# EAGLE design LoraBerry V2.2 (EAGLE 6.6.0)
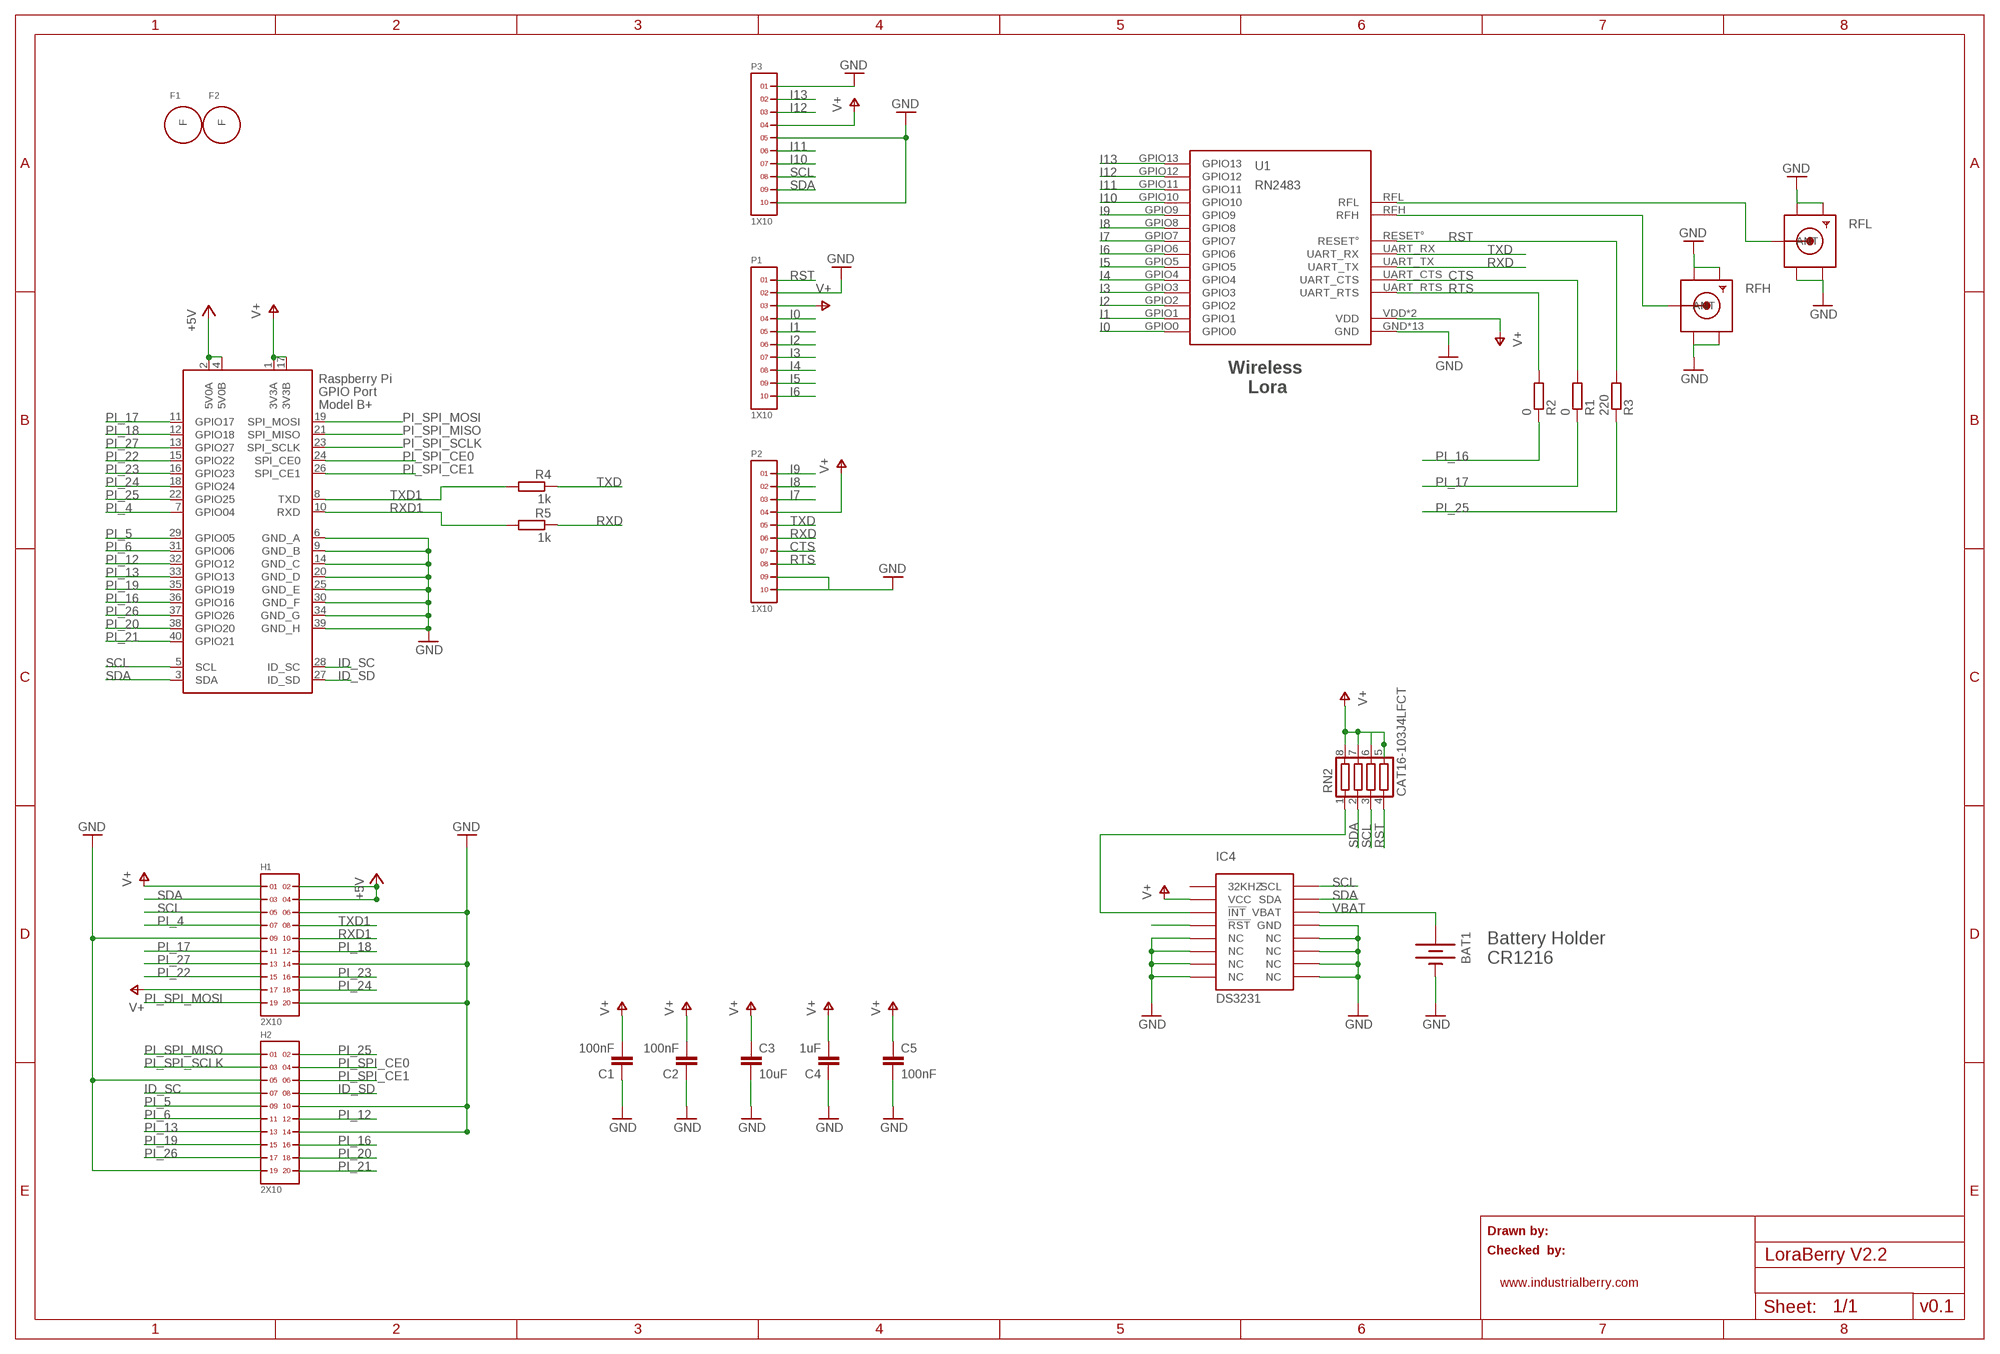
[diagram p0: schematic, sheet 1]

## Parts
BAT1  BATTERY12MM  [BATTCON_12MM]
C1  100nF  C-EUC0603  [C0603]
C2  100nF  C-EUC0603  [C0603]
C3  10uF  C-EUC1206  [C1206]
C4  1uF  C-EUC0603  [C0603]
C5  100nF  C-EUC0603  [C0603]
F1  FIDUCIAL-LAMINA  [FIDUCIAL-LAMINA]
F2  FIDUCIAL-LAMINA  [FIDUCIAL-LAMINA]
H1  2X10  [2X10]
H2  2X10  [2X10]
IC4  DS3231  DS3231SOIC-16W  [SOIC-16W]
P1  1X10  [1X10]
P2  1X10  [1X10]
P3  1X10  [1X10]
R1  0  R-EU_R0603  [R0603]
R2  0  R-EU_R0603  [R0603]
R3  220  R-EU_R0603  [R0603]
R4  1k  R-EU_R0603  [R0603]
R5  1k  R-EU_R0603  [R0603]
RFH  SMACONNECTOR_EDGE  [SMA_EDGELAUNCH]
RFL  SMACONNECTOR_EDGE  [SMA_EDGELAUNCH]
RN2  CAT16-103J4LFCT  CTS742C083  [CTS742C083]
RPI1  RASPBERRY_HATNODISPLAY  [CONNECTOR_B+_SMT_HAT_ND]
U1  RN2483  [RN2483]

## Nets
433MHZ: RFL.P(ANT) U1.RFL
868MHZ: RFH.P(ANT) U1.RFH
+5V: H1.2 H1.4 RPI1.2(5V0A) RPI1.4(5V0B)
CTS: P2.7 R1.2 U1.UART_CTS
GND: BAT1.GND(-) C1.1 C2.1 C3.2 C4.1 C5.2 H1.6 H1.9 H1.14 H1.20 H2.5 H2.10 H2.14 H2.19 IC4.5(NC) IC4.6(NC) IC4.7(NC) IC4.8(NC) IC4.9(NC) IC4.10(NC) IC4.11(NC) IC4.12(NC) IC4.13(GND) P1.2 P2.9 P2.10 P3.1 P3.5 P3.10 RFH.GND@1(GND4) RFH.GND@2(GND3) RFH.GND@3(GND2) RFH.GND@4(GND1) RFL.GND@1(GND4) RFL.GND@2(GND3) RFL.GND@3(GND2) RFL.GND@4(GND1) RPI1.6(GND_A) RPI1.9(GND_B) RPI1.14(GND_C) RPI1.20(GND_D) RPI1.25(GND_E) RPI1.30(GND_F) RPI1.34(GND_G) RPI1.39(GND_H) U1.GND U1.GND1(GND) U1.GND2(GND) U1.GND3(GND) U1.GND4(GND) U1.GND5(GND) U1.GND6(GND) U1.GND7(GND) U1.GND8(GND) U1.GND9(GND) U1.GND10(GND) U1.GND11(GND) U1.GND12(GND)
I0: P1.4 U1.GPIO0
I1: P1.5 U1.GPIO1
I2: P1.6 U1.GPIO2
I3: P1.7 U1.GPIO3
I4: P1.8 U1.GPIO4
I5: P1.9 U1.GPIO5
I6: P1.10 U1.GPIO6
I7: P2.3 U1.GPIO7
I8: P2.2 U1.GPIO8
I9: P2.1 U1.GPIO9
I10: P3.7 U1.GPIO10
I11: P3.6 U1.GPIO11
I12: P3.3 U1.GPIO12
I13: P3.2 U1.GPIO13
ID_SC: H2.7 RPI1.28(ID_SC)
ID_SD: H2.8 RPI1.27(ID_SD)
N$1: IC4.4(!RST)
N$4: IC4.3(!INT) RN2.1
PI_4: H1.7 RPI1.7(GPIO04)
PI_5: H2.9 RPI1.29(GPIO05)
PI_6: H2.11 RPI1.31(GPIO06)
PI_12: H2.12 RPI1.32(GPIO12)
PI_13: H2.13 RPI1.33(GPIO13)
PI_16: H2.16 R2.1 RPI1.36(GPIO16)
PI_17: H1.11 R1.1 RPI1.11(GPIO17)
PI_18: H1.12 RPI1.12(GPIO18)
PI_19: H2.15 RPI1.35(GPIO19)
PI_20: H2.18 RPI1.38(GPIO20)
PI_21: H2.20 RPI1.40(GPIO21)
PI_22: H1.15 RPI1.15(GPIO22)
PI_23: H1.16 RPI1.16(GPIO23)
PI_24: H1.18 RPI1.18(GPIO24)
PI_25: H2.2 R3.1 RPI1.22(GPIO25)
PI_26: H2.17 RPI1.37(GPIO26)
PI_27: H1.13 RPI1.13(GPIO27)
PI_SPI_CE0: H2.4 RPI1.24(SPI_CE0)
PI_SPI_CE1: H2.6 RPI1.26(SPI_CE1)
PI_SPI_MISO: H2.1 RPI1.21(SPI_MISO)
PI_SPI_MOSI: H1.19 RPI1.19(SPI_MOSI)
PI_SPI_SCLK: H2.3 RPI1.23(SPI_SCLK)
RST: P1.1 R3.2 RN2.4 U1.RESET°
RTS: P2.8 R2.2 U1.UART_RTS
RXD: P2.6 R5.1 U1.UART_TX
RXD1: H1.10 R5.2 RPI1.10(RXD)
SCL: H1.5 IC4.16(SCL) P3.8 RN2.3 RPI1.5(SCL)
SDA: H1.3 IC4.15(SDA) P3.9 RN2.2 RPI1.3(SDA)
TXD: P2.5 R4.1 U1.UART_RX
TXD1: H1.8 R4.2 RPI1.8(TXD)
V+: C1.2 C2.2 C3.1 C4.2 C5.1 H1.1 H1.17 IC4.2(VCC) P1.3 P2.4 P3.4 RN2.5 RN2.6 RN2.7 RN2.8 RPI1.1(3V3A) RPI1.17(3V3B) U1.VDD U1.VDD2(VDD)
VBAT: BAT1.PWR@1(+) IC4.14(VBAT)
Unconnected: F1.P$1(F) F2.P$1(F) IC4.1(32KHZ)

## Notes on the sheet
- Wireless 
  Lora
- Battery Holder 
  CR1216
- Drawn by:
- Checked  by:
- www.industrialberry.com
- v0.1

## Library data of the parts
BAT1 = SparkFun:BATTERY: Battery Holders Various common sizes : AA, AAA, 20mm coin cell and 12mm coin cell.
C1-C5 = rcl:C-EU: CAPACITOR, European symbol
F1 F2 = PierpaoloSmartSpaceSolutions:FIDUCIAL-LAMINA
H1 H2 = headers(.1in):2X10
IC4 = DS3231_industrialberry:DS3231
P1-P3 = headers(2mm):1X10
R1-R5 = rcl:R-EU_: RESISTOR, European symbol
RFH RFL = adafruit:SMACONNECTOR: SMA Connector 90° DIP SMA Connector, 50 Ohm (4UConnector: 07259)
RN2 = resistor-net:CTS742C083: Chip Resistor Array 4 Single Resistor Source: http://www.ctscorp.com/components/Datasheets/CTSChipArrayDs.pdf; OC_FARNELL: unknown; OC_NEWARK: unknown
RPI1 = Connector_B+:RASPBERRY_HAT
U1 = tobias:RN2483: RN2483 Microchip Low-Power Lora Transceiver Module NOT TESTED There are testpads on the bottom of the device. The mask is supposed to cover that, but I have not tested it in practice yet. Info: http://www.microchip.com/wwwproducts/Devices.aspx?product=RN2483 Datasheet: http://ww1.microchip.com/downloads/en/DeviceDoc/50002346B.pdf Adapted from: https://github.com/Octanis1/Octanis1-Electronics/blob/ae493cac28c100e20856abe563dfe8824e9cc4bd/lib/Octanis1.lbr

## Board
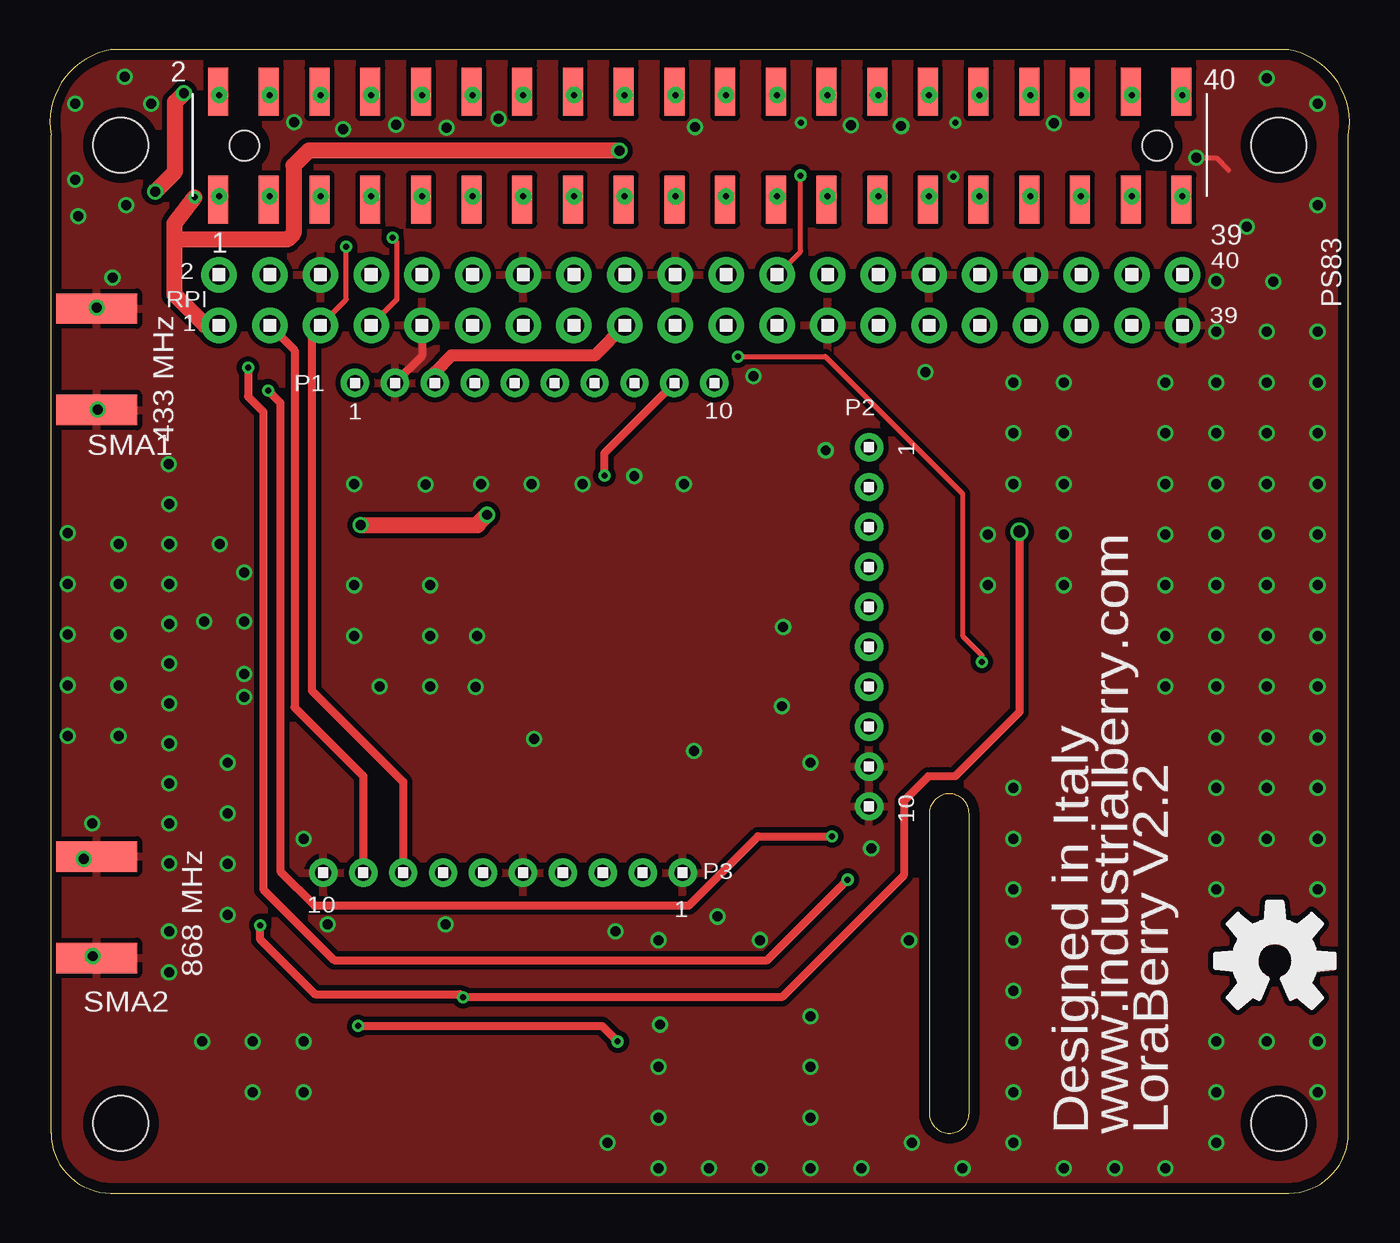
[diagram p1: board, top side]
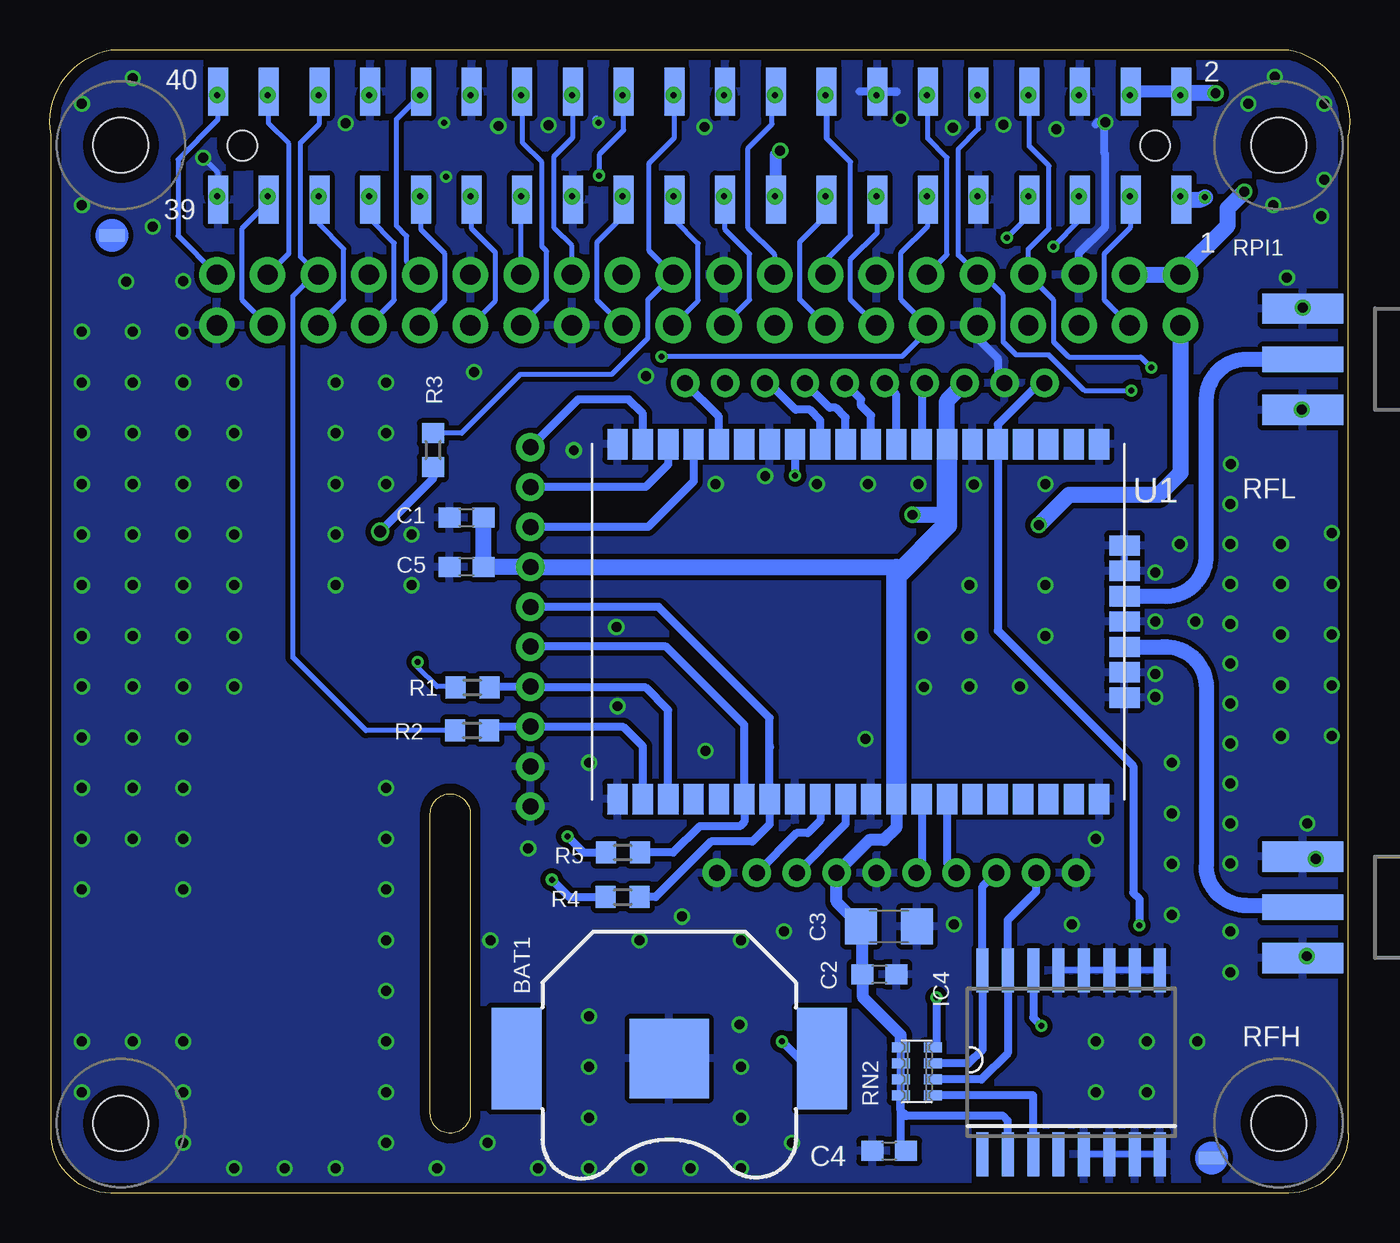
[diagram p2: board, bottom side, seen from below]

Size 65.11 x 57.27 mm. Coordinates in mm from the lower left corner, seen from the top.
Copper layers (1*16): Top 0.035mm / dielectric 1.5mm / Bottom 0.035mm
Design rules "ITEADstudio_DRC *": minimum track width 10mil, minimum drill 12mil, track to track 10mil, track to pad 10mil, pad to pad 10mil, via to via 10mil, smd to smd 0mil, copper to edge 20mil, drill to drill 20mil, minimum pad ring 10mil, minimum via ring 6mil, stop-mask expansion 2mil, vias tented up to drill 100mil, thermal gap 10mil

### Footprints (pad centres in the part's own frame; a part is rotated, then mirrored left to right if it is on the bottom)
BATTCON_12MM = smd 3.962 x 3.962: GND 0,0 | smd 2.5 x 5.1: PWR@1 -7.65,0; PWR@2 7.65,0
C0603 = smd 1.1 x 1: 1 -0.85,0; 2 0.85,0
C1206 = smd 1.6 x 1.8: 1 -1.4,0; 2 1.4,0
FIDUCIAL-LAMINA = smd 1.27 x 0.635: P$1 0,0
2X10 = drill 1.016 pad 1.778: 1 0,0; 2 0,2.54; 3 2.54,0; 4 2.54,2.54; 5 5.08,0; 6 5.08,2.54; 7 7.62,0; 8 7.62,2.54; 9 10.16,0; 10 10.16,2.54; 11 12.7,0; 12 12.7,2.54; 13 15.24,0; 14 15.24,2.54; 15 17.78,0; 16 17.78,2.54; 17 20.32,0; 18 20.32,2.54; 19 22.86,0; 20 22.86,2.54
SOIC-16W = smd 0.6 x 2.2: 1 -4.445,-4.6; 2 -3.175,-4.6; 3 -1.905,-4.6; 4 -0.635,-4.6; 5 0.635,-4.6; 6 1.905,-4.6; 7 3.175,-4.6; 8 4.445,-4.6; 9 4.445,4.6; 10 3.175,4.6; 11 1.905,4.6; 12 0.635,4.6; 13 -0.635,4.6; 14 -1.905,4.6; 15 -3.175,4.6; 16 -4.445,4.6
1X10 = drill 0.8 pad 1.422: 1 -9,0; 2 -7,0; 3 -5,0; 4 -3,0; 5 -1,0; 6 1,0; 7 3,0; 8 5,0; 9 7,0; 10 9,0
R0603 = smd 1 x 1.1: 1 -0.85,0; 2 0.85,0
SMA_EDGELAUNCH = smd 4.064 x 1.524: GND@1 2.032,-2.54; GND@2 2.032,2.54 | smd 4.064 x 1.524 bottom: GND@3 2.032,2.54; GND@4 2.032,-2.54 | smd 4.064 x 1.27: P 2.032,0
CTS742C083 = smd 0.5 x 0.9: 1 -1.2,-0.8; 2 -0.4,-0.8; 3 0.4,-0.8; 4 1.2,-0.8; 5 1.2,0.8; 6 0.4,0.8; 7 -0.4,0.8; 8 -1.2,0.8
CONNECTOR_B+_SMT_HAT_ND = smd 1 x 2.4 bottom: 1 -24.18,-2.7; 2 -24.18,2.7; 3 -21.64,-2.7; 4 -21.64,2.7; 5 -19.1,-2.7; 6 -19.1,2.7; 7 -16.56,-2.7; 8 -16.56,2.7; 9 -14.02,-2.7; 10 -14.02,2.7; 11 -11.48,-2.7; 12 -11.48,2.7; 13 -8.94,-2.7; 14 -8.94,2.7; 15 -6.4,-2.7; 16 -6.4,2.7; 17 -3.86,-2.7; 18 -3.86,2.7; 19 -1.32,-2.7; 20 -1.32,2.7; 21 1.22,-2.7; 22 1.22,2.7; 23 3.76,-2.7; 24 3.76,2.7; 25 6.3,-2.7; 26 6.3,2.7; 27 8.84,-2.7; 28 8.84,2.7; 29 11.38,-2.7; 30 11.38,2.7; 31 13.92,-2.7; 32 13.92,2.7; 33 16.46,-2.7; 34 16.46,2.7; 35 19,-2.7; 36 19,2.7; 37 21.54,-2.7; 38 21.54,2.7; 39 24.08,-2.7; 40 24.08,2.7 | drill 0.3: P$1 -24.13,-2.54; P$2 -24.13,2.54; P$3 -21.59,-2.54; P$4 -21.59,2.54; P$5 -19.05,-2.54; P$6 -19.05,2.54; P$7 -16.51,-2.54; P$8 -16.51,2.54; P$9 -13.97,-2.54; P$10 -13.97,2.54; P$11 -11.43,-2.54; P$12 -11.43,2.54; P$13 -8.89,-2.54; P$14 -8.89,2.54; P$15 -6.35,-2.54; P$16 -6.35,2.54; P$17 -3.81,-2.54; P$18 -3.81,2.54; P$19 -1.27,-2.54; P$20 -1.27,2.54; P$21 1.27,-2.54; P$22 1.27,2.54; P$23 3.81,-2.54; P$24 3.81,2.54; P$25 6.35,-2.54; P$26 6.35,2.54; P$27 8.89,-2.54; P$28 8.89,2.54; P$29 11.43,-2.54; P$30 11.43,2.54; P$31 13.97,-2.54; P$32 13.97,2.54; P$33 16.51,-2.54; P$34 16.51,2.54; P$35 19.05,-2.54; P$36 19.05,2.54; P$37 21.59,-2.54; P$38 21.59,2.54; P$39 24.13,-2.54; P$40 24.13,2.54 | smd 1 x 2.4: T1 -24.18,-2.7; T2 -24.18,2.7; T3 -21.64,-2.7; T4 -21.64,2.7; T5 -19.1,-2.7; T6 -19.1,2.7; T7 -16.56,-2.7; T8 -16.56,2.7; T9 -14.02,-2.7; T10 -14.02,2.7; T11 -11.48,-2.7; T12 -11.48,2.7; T13 -8.94,-2.7; T14 -8.94,2.7; T15 -6.4,-2.7; T16 -6.4,2.7; T17 -3.86,-2.7; T18 -3.86,2.7; T19 -1.32,-2.7; T20 -1.32,2.7; T21 1.22,-2.7; T22 1.22,2.7; T23 3.76,-2.7; T24 3.76,2.7; T25 6.3,-2.7; T26 6.3,2.7; T27 8.84,-2.7; T28 8.84,2.7; T29 11.38,-2.7; T30 11.38,2.7; T31 13.92,-2.7; T32 13.92,2.7; T33 16.46,-2.7; T34 16.46,2.7; T35 19,-2.7; T36 19,2.7; T37 21.54,-2.7; T38 21.54,2.7; T39 24.08,-2.7; T40 24.08,2.7 | hole 2.75: -29.05,-48.97; -29.05,0.03; 28.95,-48.97; 28.95,0.03 | hole 1.5: -22.86,0; 22.86,0
RN2483 = smd 1.524 x 1.016: GND 17.78,1.27; GND1 17.78,10.16; GND2 17.78,13.97; GND3 17.78,25.4; GND9 0,25.4; GND10 0,19.05; GND11 0,8.89; GND12 0,1.27; GPIO0 0,16.51; GPIO1 0,15.24; GPIO2 0,13.97; GPIO3 0,12.7; GPIO4 0,11.43; GPIO5 0,10.16; GPIO6 0,6.35; GPIO7 0,5.08; GPIO8 0,3.81; GPIO9 0,2.54; GPIO10 17.78,17.78; GPIO11 17.78,16.51; GPIO12 17.78,12.7; GPIO13 17.78,11.43; P$1 0,21.59; P$2 0,22.86; P$3 0,24.13; P$4 17.78,24.13; P$5 17.78,22.86; P$6 17.78,21.59; P$7 17.78,20.32; P$8 17.78,19.05; P$9 17.78,6.35; P$10 17.78,5.08; P$11 0,7.62; RESET° 0,20.32; UART_CTS 17.78,3.81; UART_RTS 17.78,2.54; UART_RX 17.78,8.89; UART_TX 17.78,7.62; VDD 17.78,15.24; VDD2 0,17.78 | smd 1.016 x 1.524: GND4 12.7,26.67; GND5 11.43,26.67; GND6 8.89,26.67; GND7 6.35,26.67; GND8 5.08,26.67; RFH 10.16,26.67; RFL 7.62,26.67

### Placement (x,y rotation side)
BAT1  34.08,6.74 180 bottom
C1  44.23,33.84 0 bottom
C2  23.55,10.96 180 bottom
C3  23.07,13.37 0 bottom
C4  23.06,2.11 0 bottom
C5  44.23,31.37 180 bottom
F1  6.91,1.76 0 bottom
F2  62,47.97 0 bottom
H1  8.47,43.47 0 top
H2  33.88,43.47 0 top
IC4  13.94,6.55 0 bottom
P1  24.28,40.58 0 top
P2  41.03,28.37 270 top
P3  22.69,16.05 180 top
R1  43.94,25.33 0 bottom
R2  43.95,23.17 0 bottom
R3  45.91,37.22 270 bottom
R4  36.41,14.83 180 bottom
R5  36.4,17.06 180 bottom
RFH  0.3,14.32 180 bottom
RFL  0.3,41.77 180 bottom
RN2  21.68,6.09 90 bottom
RPI1  32.6,52.47 0 top
U1  37.94,37.52 270 bottom

### Tracks (layer width: path | path; a pad name or v marks a point on that pad's centre or on a via)
433MHZ
  Bottom 0.254: RFL.P 2.54,41.88 2.55,41.74
  Bottom 0.406: 7.18,31.78 arc-90 7.18,31.79 | 2.25,41.74 2.62,41.74
  Bottom 0.75: 2.25,41.74 2.55,41.74 5.12,41.76 arc-90 7.18,39.79 7.18,31.79 | U1.RFL 9.36,29.9 arc-90 7.18,31.78
868MHZ
  Bottom 0.406: 5.12,14.32 5.12,14.4 | 2.34,14.4 RFH.P
  Bottom 0.75: U1.RFH 9.36,27.36 arc90 7.18,25.47 7.18,16.36 arc-90 5.12,14.4 2.34,14.4
+5V  (via drill 0.5)
  Top 0.813: v6.71,55.09 6.27,54.65 6.27,51.18 v5.26,50.17
  Bottom 0.61: RPI1.4 RPI1.2
  Bottom 0.813: H1.4 H1.2 8.47,46.1 6.1,48.47 6.1,49.33 v5.26,50.17 | v6.71,55.09 8.34,55.09 RPI1.2
CTS
  Bottom 0.305: 41.71,25.36 P2.7
  Bottom 0.406: U1.UART_CTS 34.13,24.2 35.25,25.32 40.98,25.32 P2.7 | 41.71,25.36 43.06,25.36 R1.2
GND  (via drill 0.3, 0.5)
  Top 0.254: v57.43,51.86 58.42,51.86 59.05,51.23
  Top 0.406: H1.9 18.63,41.94 17.29,40.6
  Bottom 0.254: RPI1.39 56.68,51.11 v57.43,51.86
  Bottom 0.305: U1.GND12 36.97,37.82 | IC4.8 IC4.7 IC4.6 IC4.5 | IC4.9 IC4.10 IC4.11 IC4.12 IC4.13 | U1.GND8 U1.GND7
  Bottom 0.406: RPI1.14 22.68,55.17 22.68,55.18 24.54,55.18 24.54,55.2 | H1.9 18.63,42.82 17.62,41.81 17.62,40.89 17.24,40.51 | 37.73,53.78 v37.62,53.62 | H1.6 13.55,47.09 12.24,48.4 12.24,52.05 12.28,52.09 12.28,53.6 v12.23,53.65 12.61,53.65 12.73,53.53
  other vias: 9.73,31.09 9.73,28.63 9.73,26 9.73,24.85 5.97,34.52 5.97,32.52 5.97,30.52 5.97,28.52 5.97,26.52 5.97,24.52 5.97,22.52 5.97,20.52 5.95,36.52 2.33,44.35 3.13,45.86 1.68,16.73 2.15,11.87 7.73,28.63 2.38,39.24 2.12,18.52 5.97,18.52 5.97,16.52 5.96,13.1 5.96,11.05 8.51,32.52 1.41,48.95 22.48,53.83 17.33,53.52 38.86,37.21 43.85,41.12 35.24,40.92 19.82,13.45 28.34,13.11 60.96,43.15 60.96,38.07 55.88,38.07 55.88,32.99 48.26,38.07 60.96,32.99 60.96,27.91 55.88,27.91 60.96,22.83 60.96,17.75 48.26,17.75 48.26,12.67 48.26,7.59 48.26,2.51 60.96,7.59 43.18,2.51 38.1,6.32 30.48,6.32 30.48,12.67 35.56,12.67 43.04,12.66 12.7,5.05 10.16,7.59 10.16,5.05 7.62,7.59 12.7,7.59 12.7,17.75 3.75,55.92 14.69,53.3 19.86,53.37 29.27,35.93 24.26,22.76 15.24,35.53 18.81,35.5 21.59,35.53 24.13,35.53 26.67,35.53 31.75,35.53 19.05,30.45 15.24,30.45 19.05,27.91 15.24,27.91 19.05,25.37 16.51,25.37 21.33,25.36 21.4,27.91 32.27,22.15 38.1,21.56 50.8,32.99 50.8,38.07 50.8,35.53 55.88,35.53 60.96,35.53 58.42,35.53 58.42,38.07 58.42,32.99 55.88,30.45 58.42,30.45 60.96,30.45 58.42,27.91 55.88,40.61 58.42,40.61 60.96,40.61 50.8,40.61 48.26,40.61 48.26,35.53 50.8,30.45 46.99,30.45 46.99,32.99 55.88,25.37 58.42,25.37 60.96,25.37 58.42,22.83 63.5,32.99 63.5,30.45 63.5,27.91 63.5,35.53 63.5,38.07 63.5,40.61 63.5,43.15 60.96,20.29 63.5,20.29 63.5,22.83 63.5,25.37 58.42,20.29 58.42,17.75 63.5,17.75 58.42,15.21 63.5,15.21 58.42,7.59 63.5,7.59 58.42,5.05 58.42,2.51 63.5,5.05 55.88,1.24 53.34,1.24 50.8,1.24 48.26,5.05 48.26,10.13 48.26,15.21 48.26,20.29 33.43,13.85 30.55,8.44 41.14,17.27 38.1,8.86 38.1,3.78 38.1,1.24 40.64,1.24 45.72,1.24 35.56,1.24 33.02,1.24 30.48,1.24 30.48,3.78 27.94,2.51 8.89,13.94 8.89,16.48 8.89,19.02 8.89,21.56 13.91,13.45 61.29,45.65 58.42,45.69 58.42,43.15 63.5,49.5 59.95,48.41 63.5,54.58 60.96,55.85 3.81,49.5 5.08,54.58 1.27,54.58 1.27,50.77 32.32,53.41 42.64,53.46 50.3,53.6 40.12,53.49 36.73,28.36 36.67,24.39 3.43,32.52 3.43,30.52 3.43,27.98 3.43,25.44 3.43,22.9 0.89,22.9 0.89,25.44 0.89,27.98 0.89,30.52 0.89,33.06 45.25,50.92 45.35,53.62
  pour Bottom: 0,-0.03 0,57.57 65,57.57 65,-0.03
  pour Top: 0,-0.03 0,57.57 65,57.57 65,-0.03
I0
  Bottom 0.406: P1.4 21.43,40.43 U1.GPIO0
I1
  Bottom 0.406: U1.GPIO1 22.7,40 P1.5
I2
  Bottom 0.406: U1.GPIO2 23.97,38.95 24.47,39.45 24.47,39.77 P1.6
I3
  Bottom 0.406: U1.GPIO3 25.24,38.86 25.73,39.35 26.05,39.35 P1.7
I4
  Bottom 0.406: U1.GPIO4 26.51,38.71 27.04,39.24 27.75,39.24 29.09,40.58 P1.8
I5  (via drill 0.3)
  Top 0.406: v27.77,35.94 27.77,37.07 P1.9
  Bottom 0.406: U1.GPIO5 v27.77,35.94
I6
  Bottom 0.406: U1.GPIO6 31.59,38.89 P1.10
I7
  Bottom 0.406: U1.GPIO7 32.86,35.65 35.14,33.37 P2.3
I8
  Bottom 0.406: U1.GPIO8 34.13,36.5 35.26,35.37 P2.2
I9
  Bottom 0.406: U1.GPIO9 35.4,39.05 36.11,39.76 38.64,39.76 P2.1
I10
  Bottom 0.406: U1.GPIO10 20.16,16.52 P3.7
I11
  Bottom 0.406: U1.GPIO11 21.43,16.31 P3.6
I12
  Bottom 0.406: U1.GPIO12 25.24,18.5 P3.3
I13
  Bottom 0.406: U1.GPIO13 26.51,18.67 27.14,18.04 27.7,18.04 P3.2
ID_SC
  Bottom 0.254: RPI1.28 41.42,55.15 41.42,52.6 40.46,51.64 40.46,47.42 40.22,47.18 40.22,44.75 H2.7
ID_SD
  Bottom 0.254: H2.8 41.5,49.77 RPI1.27
N$4
  Bottom 0.406: IC4.3 15.85,4.89 RN2.1
N$17
  Top 0.2: 60.27,9.88 arc10 60.58,9.72 61.01,10.76 arc-247 62.3,11.63 arc-67 61.72,10.76 62.15,9.72 arc10 62.46,9.88 63.21,9.27 63.73,9.78 63.11,10.54 arc19 63.37,11.17 64.34,11.26 64.34,12 63.37,12.09 arc19 63.11,12.72 63.73,13.48 63.21,13.99 62.46,13.38 arc19 61.83,13.64 61.73,14.61 61,14.61 60.9,13.64 arc19 60.27,13.38 59.52,13.99 59,13.48 59.62,12.72 arc19 59.35,12.09 58.39,12 58.39,11.26 59.35,11.17 arc19 59.62,10.54 59,9.78 59.52,9.27 60.27,9.88
PI_4  (via drill 0.3)
  Top 0.254: v17.16,47.87 17.37,47.66 17.37,44.75 H1.7
  Bottom 0.254: RPI1.7 16.14,49.77 16.14,48.89 v17.16,47.87
PI_5
  Bottom 0.254: H2.9 42.79,44.72 42.79,47.12 43.98,48.31 RPI1.29
PI_6
  Bottom 0.254: H2.11 45.31,44.74 45.31,47.06 46.52,48.27 RPI1.31
PI_12
  Bottom 0.254: H2.12 47.23,46.66 47.23,47.95 47.74,48.46 47.74,53.8 46.52,55.02 RPI1.32
PI_13
  Bottom 0.254: H2.13 47.85,44.74 47.85,47.6 49.06,48.81 RPI1.33
PI_16
  Bottom 0.254: RPI1.36 51.6,53.58 52.55,52.63 52.55,46.9 H2.16 51.86,46.01 52.93,44.94 52.93,26.83 49.27,23.17 R2.1
PI_17  (via drill 0.3)
  Top 0.254: v34.47,41.91 38.84,41.91 45.71,35.04 45.71,27.91 45.72,27.91 46.69,26.94 v46.69,26.6
  Bottom 0.254: H1.11 | H1.11 22.46,44.76 22.46,47.11 21.12,48.45 RPI1.11 | H1.11 21.18,43.15 22.42,41.91 v34.47,41.91 | R1.1 44.45,25.37 45.72,25.37 46.69,26.34 v46.69,26.6
PI_18
  Bottom 0.254: H1.12 20.16,47.02 20.16,51.88 21.12,52.84 RPI1.12
PI_19
  Bottom 0.254: H2.15 50.38,44.75 50.38,47.31 51.6,48.53 RPI1.35
PI_20
  Bottom 0.254: H2.18 53.13,47.08 53.13,52.56 54.14,53.57 RPI1.38
PI_21
  Bottom 0.254: H2.20 58.69,47.96 58.69,51.78 56.68,53.79 RPI1.40
PI_22
  Bottom 0.254: H1.15 27.53,44.75 27.53,47.66 26.2,48.99 RPI1.15
PI_23
  Bottom 0.254: 26.2,54.99 RPI1.16 | 26.2,52.85 25,51.65 25,47.97 26.25,46.72 H1.16
  Bottom 0.305: 26.2,54.99 26.2,52.85
PI_24
  Bottom 0.254: H1.18 28.79,47.01 30.13,48.35 30.13,52.35 28.92,53.56 28.92,54.99 RPI1.18
PI_25
  Bottom 0.254: H2.2 35.08,47.21 | 35.08,47.21 35.08,51.6 33.82,52.86 RPI1.22 | 35.08,47.21 35.08,47.2 H2.2 35.16,44.74 35.16,42.81 36.96,41.01 41.54,41.01 44.48,38.07 R3.1
PI_26
  Bottom 0.254: H2.17 55.47,44.74 55.47,48.33 54.14,49.66 RPI1.37
PI_27
  Bottom 0.254: H1.13 24.99,44.75 24.99,46.78 23.66,48.11 RPI1.13 23.66,49.04
PI_SPI_CE0  (via drill 0.3)
  Top 0.254: H2.4 37.61,47.2 37.59,47.22 v37.59,50.98
  Bottom 0.254: RPI1.24 36.36,53.25 37.59,52.02 v37.59,50.98
PI_SPI_CE1
  Bottom 0.254: RPI1.26 38.9,52.89 39.84,51.95 39.84,48.34 38.96,47.46 H2.6
PI_SPI_MISO
  Bottom 0.254: H2.1 32.63,44.72 32.63,47.57 33.82,48.76 RPI1.21
PI_SPI_MOSI
  Bottom 0.254: H1.19 30.05,44.75 30.05,47.04 31.28,48.27 RPI1.19
PI_SPI_SCLK
  Bottom 0.254: H2.3 37.69,44.74 37.69,47.64 36.36,48.97 RPI1.23
RST  (via drill 0.3, 0.6)
  Top 0.406: v48.57,33.13 48.57,24.11 45.34,20.88 44,20.88 42.77,19.65 42.77,15.92 36.66,9.81 v20.69,9.81 20.54,9.96 13.27,9.96 10.53,12.7 v10.53,13.42
  Bottom 0.305: RN2.4 20.69,7.48
  Bottom 0.406: P1.1 15.54,40.58 17.62,38.5 U1.RESET° 17.62,28.18 10.83,21.39 10.83,15.05 10.53,14.75 v10.53,13.42 | v20.69,9.81 20.69,7.48 | R3.2 45.91,35.79 v48.57,33.13
RTS
  Bottom 0.406: U1.UART_RTS 35.4,22.38 36.37,23.35 41.01,23.35 P2.8 42.9,23.37 R2.2
RXD
  Bottom 0.406: P2.6 34.23,27.37 30.32,23.46 U1.UART_TX 30.32,18.6 30.54,18.38 32.56,18.38 33.88,17.06 R5.1
RXD1  (via drill 0.3)
  Top 0.406: v10.92,40.21 11.54,39.59 11.54,16.12 13.25,14.41 32,14.41 35.46,17.87 v39.18,17.87
  Bottom 0.254: RPI1.10 18.58,53.31 19.6,52.29 19.6,46.98 H1.10 18.38,46.01 17.35,44.98 17.35,42.64 16.7,41.99 15.05,41.99 13.27,40.21 v10.92,40.21
  Bottom 0.406: v39.18,17.87 38.37,17.06 R5.2
SCL  (via drill 0.3)
  Top 0.254: H1.5 14.84,44.76 v14.84,47.42
  Top 0.406: P3.8 17.69,20.6 13.13,25.16 13.13,43.05 H1.5
  Bottom 0.254: 13.5,48.7 13.5,48.76 | 13.5,48.76 RPI1.5 | v14.84,47.42 13.5,48.76
  Bottom 0.406: P3.8 18.39,15.35 IC4.16 18.39,7.18 19.08,6.49 RN2.3
SDA
  Top 0.406: P3.9 15.69,20.89 12.25,24.33 12.25,42.23 H1.3
  Bottom 0.254: H1.3 12.28,44.74 12.28,47.07 10.96,48.39 RPI1.3
  Bottom 0.406: P3.9 15.69,15.11 17.12,13.68 IC4.15 17.12,7 18.43,5.69 RN2.2
TXD
  Bottom 0.305: 28.98,22.33 29.05,22.4
  Bottom 0.406: P2.5 34.61,29.37 29.05,23.81 29.05,22.4 U1.UART_RX 29.05,18.47 29.91,17.61 31.98,17.61 34.76,14.83 R4.1
TXD1  (via drill 0.3)
  Top 0.406: v9.92,41.35 9.92,39.91 10.68,39.15 10.68,15.22 14.24,11.66 35.92,11.66 v39.96,15.7
  Bottom 0.254: RPI1.8 16.04,52.44 15.06,51.46 15.06,48.32 16.09,47.29 H1.8 14.81,44.73 14.81,42.64 14.06,41.89 10.46,41.89 v9.92,41.35
  Bottom 0.406: v39.96,15.7 39.09,14.83 R4.2
V+  (via drill 0.3, 0.5)
  Top 0.61: H1.17 27.28,41.96 20.1,41.96 19.28,41.14 P1.3
  Top 0.813: v15.57,33.46 21.41,33.46 21.45,33.5 21.45,33.53 v21.9,33.98 | H1.1 7.77,43.47 6.24,45 6.24,47.67 | 6.24,47.67 6.24,48.58 v7.24,49.88 | v28.52,52.23 12.96,52.23 12.2,51.47 12.2,48.07 11.9,47.77 6.34,47.77 arc90 6.24,47.67
  Bottom 0.406: IC4.2 17.12,3.62 17.35,3.86 22.2,3.86 22.49,4.15 RN2.8 | RN2.8 RN2.7 RN2.6 RN2.5 | C4.2 22.48,2.38 RN2.8
  Bottom 0.61: RN2.5 22.48,7.91 24.37,9.8 24.37,10.93 C2.2 24.4,13.3 C3.1 25.69,14.59 P3.4 24.06,17.68 23.32,17.68 22.7,18.3 U1.VDD | RPI1.17 28.74,52.01 v28.52,52.23
  Bottom 0.813: 22.7,30.27 22.7,31.37 P2.4 C5.1 C1.2 | H1.1 8.47,36.08 9.57,34.98 14.05,34.98 v15.57,33.46 | v21.9,33.98 20.2,33.98 20.16,34.02 | RPI1.17 28.74,50.44 | U1.VDD2 20.16,39.7 P1.3 | RPI1.1 7.43,49.77 v7.24,49.88
  Bottom 1.016: U1.VDD 22.7,30.27 22.7,30.92 20.16,33.46 20.16,34.02 U1.VDD2
VBAT  (via drill 0.3)
  Top 0.406: v15.43,8.37 27.66,8.37 v28.44,7.59
  Bottom 0.406: IC4.14 15.85,8.78 v15.43,8.37 | v28.44,7.59 27.59,6.74 BAT1.PWR@1

### Text on the board
tPlace: Designed in Italy | www.industrialberry.com | LoraBerry V2.2
_tNames: 2 | 40 | RPI | 39 | 1 | P1 | P2 | 1 | 10 | 433 MHz | 1 | SMA1 | 10 | P3 | 10 | 1 | 868 MHz | SMA2